# Altium schematic sheet HMC1001_module.SchDoc
size A1
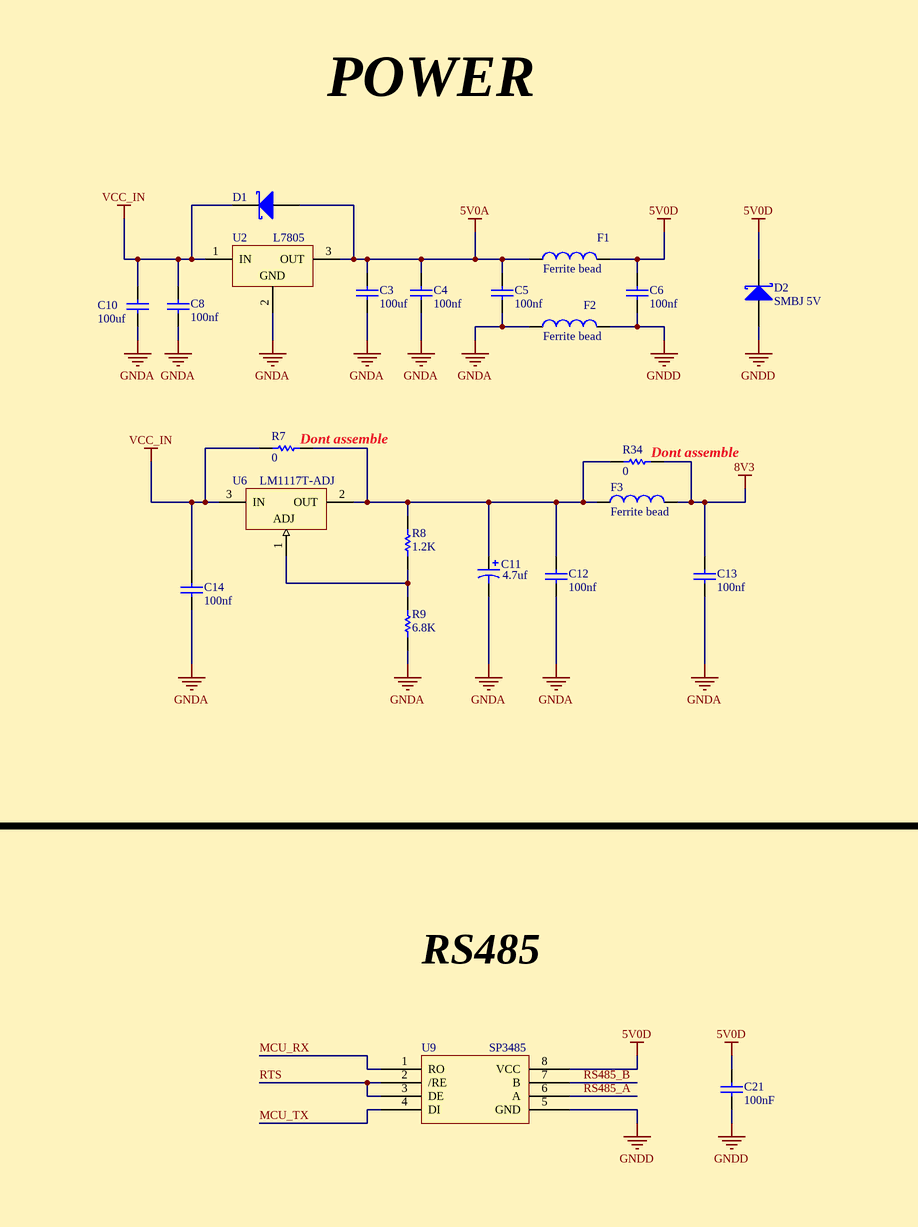
[diagram p0: HMC1001_module.SchDoc, top left]
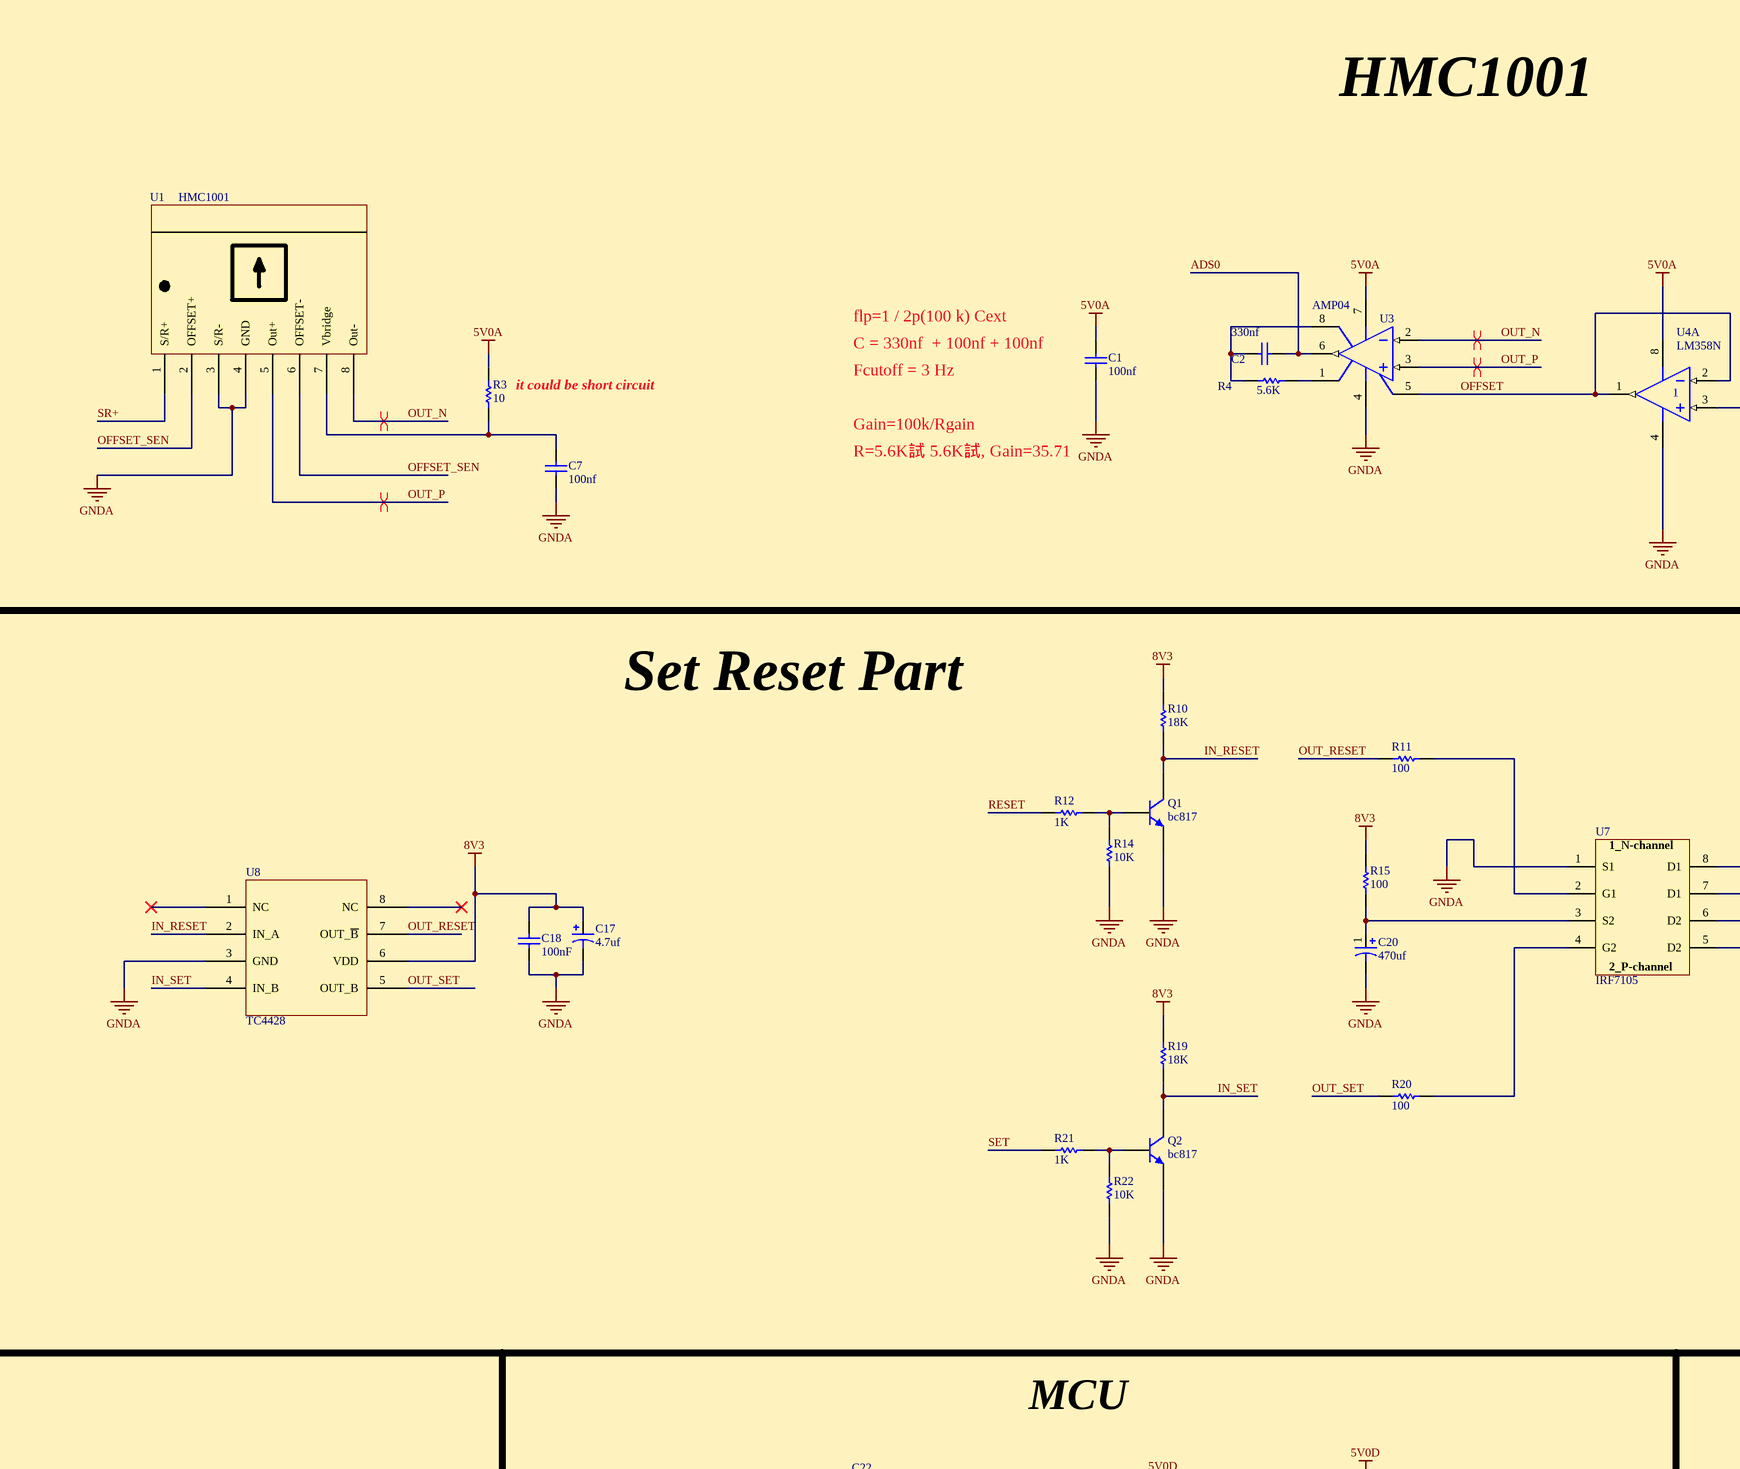
[diagram p1: HMC1001_module.SchDoc, top middle]
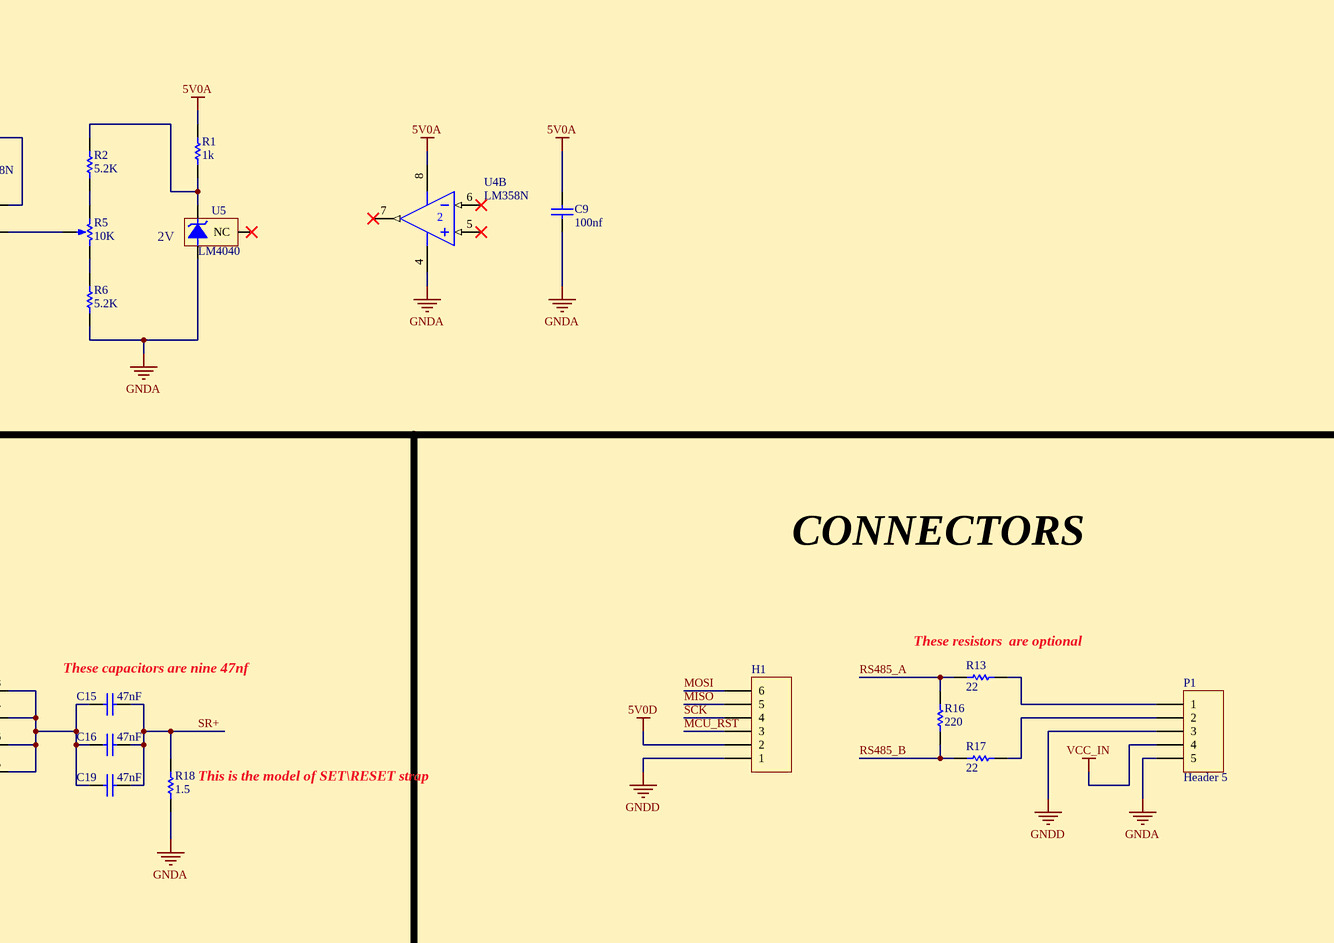
[diagram p2: HMC1001_module.SchDoc, top right]
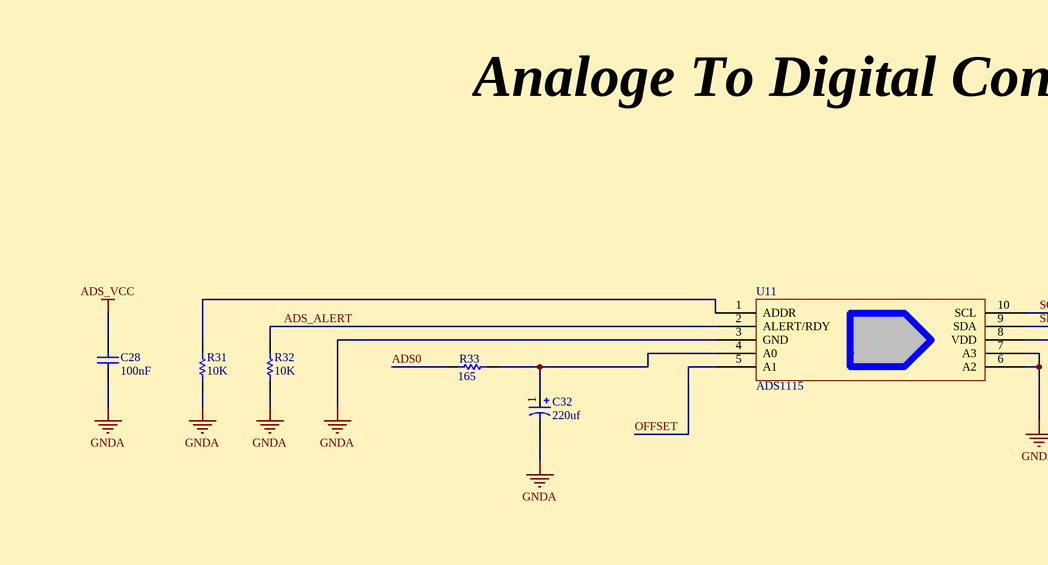
[diagram p3: HMC1001_module.SchDoc, bottom left]
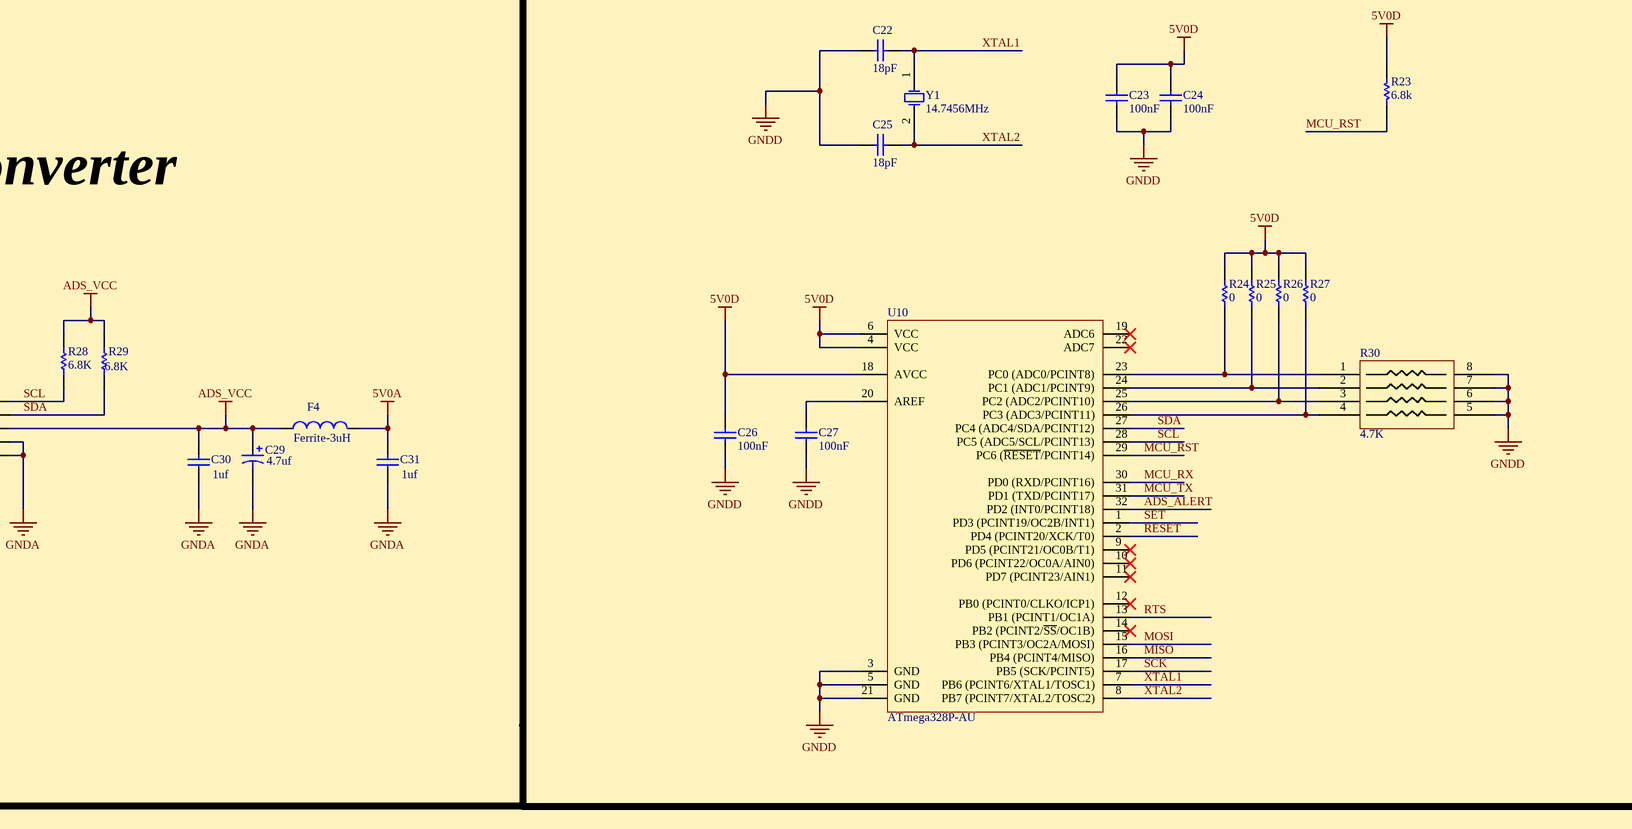
[diagram p4: HMC1001_module.SchDoc, bottom middle]
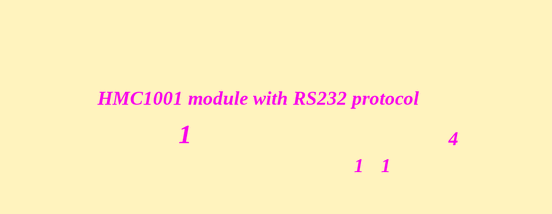
[diagram p5: HMC1001_module.SchDoc, bottom right]

## Parts
C1  100nf  [C0805]
C2  330nf  [C0805]
C3  100uf  [C1206]
C4  100nf  [C0805]
C5  100nf  [C0805]
C6  100nf  [C0805]
C7  100nf  [C0805]
C8  100nf  [C0805]
C9  100nf  [C0805]
C10  100uf  [C1206]
C11  4.7uf  [cap_smd_a]
C12  100nf  [C0805]
C13  100nf  [C0805]
C14  100nf  [C0805]
C15  47nF  [C1206]
C16  47nF  [C1206]
C17  4.7uf  [cap_smd_a]
C18  100nF  [C0805]
C19  47nF  [C1206]
C20  470uf  [cap_smd_d]
C21  100nF  [C0805]
C22  18pF  [C0805]
C23  100nF  [C0805]
C24  100nF  [C0805]
C25  18pF  [C0805]
C26  100nF  [C0805]
C27  100nF  [C0805]
C28  100nF  [C0805]
C29  4.7uf  [CAP_SMD_A]
C30  1uf  [C0805]
C31  1uf  [C0805]
C32  220uf  [cap_smd_d]
D1  D Schottky  [ZENER]  (value not drawn)
D2  SMBJ 5V  [TVS]
F1  Ferrite bead  [1206]
F2  Ferrite bead  [1206]
F3  Ferrite bead  [1206]
F4  Ferrite-3uH  [1206]
H1  White SMD Connector 6pin  [SH_6pin_B]  (value not drawn)
P1  Header 5  [HDR_M_1x5]
Q1  bc817  [sot-23]
Q2  bc817  [sot-23]
R1  1k  [0805]
R2  5.2K  [0805]
R3  10  [0805]
R4  5.6K  [0805]
R5  value 10K  [POT_3296w]  (hidden comment: RPot)
R6  5.2K  [0805]
R7  0  [0603]
R8  1.2K  [0805]
R9  6.8K  [0805]
R10  18K  [0805]
R11  100  [0805]
R12  1K  [0805]
R13  22  [0805]
R14  10K  [0805]
R15  100  [0805]
R16  220  [0805]
R17  22  [0805]
R18  1.5  [0805]
R19  18K  [0805]
R20  100  [0805]
R21  1K  [0805]
R22  10K  [0805]
R23  6.8k  [0805]
R24  0  [0603]
R25  0  [0603]
R26  0  [0603]
R27  0  [0603]
R28  6.8K  [0805]
R29  6.8K  [0805]
R30  4.7K  [RP0603X4]
R31  10K  [0805]
R32  10K  [0805]
R33  165  [0805]
R34  0  [0603]
U1  HMC1001  [HMC1001]
U2  L7805  [DPAK]
U3  AMP04  [sop8]
U4  LM358N  [sop8]  (parts A,B of 2)
U5  LM4040  [sot-23]
U6  LM1117T-ADJ  [DPAK]
U7  IRF7105  [sop8]
U8  TC4428  [sop8]
U9  SP3485  [SOP8]
U10  ATmega328P-AU  [32A_L]
U11  ADS1115  [TSSOP10_N]
Y1  14.7456MHz  [XTALL]

## Nets
5V0A: C1.2 C3.2 C4.2 C5.2 C9.2 C31.2 D1.1(A) F1.1 F4.2 R1.2 R3.2 U2.3(OUT) U3.7(V+) U4.8(V+)
5V0D: C6.2 C21.2 C23.2 C24.2 C26.2 D2.2(K) F1.2 H1.2 R23.1 R24.1 R25.1 R26.1 R27.1 U9.8(VCC) U10.4(VCC) U10.6(VCC) U10.18(AVCC)
8V3: C13.2 C17.1 C18.1 F3.2 R10.2 R15.1 R19.2 R34.1 U8.6(VDD)
ADS_VCC: C28.2 C29.1 C30.2 F4.1 R28.1 R29.1 U11.8(VDD)
GNDA: C1.1 C3.1 C4.1 C5.1 C7.1 C8.1 C9.1 C10.1 C11.2 C12.1 C13.1 C14.1 C17.2 C18.2 C20.2 C28.1 C29.2 C30.1 C31.1 C32.2 F2.1 P1.5 Q1.2(E) Q2.2(E) R6.1 R9.1 R14.1 R18.2 R22.1 R31.1 R32.1 U1.3(S/R-) U1.4(GND) U2.2(GND) U3.4(V-) U4.4(V-) U5.2(-V) U7.1(S1) U8.3(GND) U11.3(GND) U11.6(A2) U11.7(A3)
GNDD: C6.1 C21.1 C22.1 C23.1 C24.1 C25.1 C26.1 C27.1 D2.1(A) F2.2 H1.1 P1.3 R30.5 R30.6 R30.7 R30.8 U9.5(GND) U10.3(GND) U10.5(GND) U10.21(GND)
VCC_IN: C8.2 C10.2 C14.2 D1.2(K) P1.4 R7.2 U2.1(IN) U6.3(IN)
ADS0: C2.1 R33.1 U3.6(OUT)
ADS_ALERT: R32.2 U10.32(PD2_(INT0/PCINT18)) U11.2(ALERT/RDY)
IN_RESET: Q1.3(C) R10.1 U8.2(IN_A)
IN_SET: Q2.3(C) R19.1 U8.4(IN_B)
MCU_RST: H1.3 R23.2 U10.29(PC6_(~{RESET}/PCINT14))
MCU_RX: U9.1(RO) U10.30(PD0_(RXD/PCINT16))
MCU_TX: U9.4(DI) U10.31(PD1_(TXD/PCINT17))
MISO: H1.5 U10.16(PB4_(PCINT4/MISO))
MOSI: H1.6 U10.15(PB3_(PCINT3/OC2A/MOSI))
OFFSET: U3.5(OS_NUL) U4.1(OUT) U4.2(IN-) U11.5(A1)
OFFSET_SEN: U1.2(OFFSET+) U1.6(OFFSET-)
OUT_N: U1.8(Out-) U3.2(IN-)
OUT_P: U1.5(Out+) U3.3(IN+)
OUT_RESET: R11.2 U8.7(OUT_~{B})
OUT_SET: R20.2 U8.5(OUT_B)
RESET: R12.1 U10.2(PD4_(PCINT20/XCK/T0))
RS485_A: R13.1 R16.1 U9.6(A)
RS485_B: R16.2 R17.1 U9.7(B)
RTS: U9.2(/RE) U9.3(DE) U10.13(PB1_(PCINT1/OC1A))
SCK: H1.4 U10.17(PB5_(SCK/PCINT5))
SCL: R28.2 U10.28(PC5_(ADC5/SCL/PCINT13)) U11.10(SCL)
SDA: R29.2 U10.27(PC4_(ADC4/SDA/PCINT12)) U11.9(SDA)
SET: R21.1 U10.1(PD3_(PCINT19/OC2B/INT1))
SR+: C15.2 C16.2 C19.2 R18.1 U1.1(S/R+)
XTAL1: C22.2 U10.7(PB6_(PCINT6/XTAL1/TOSC1)) Y1.1(OSC1)
XTAL2: C25.2 U10.8(PB7_(PCINT7/XTAL2/TOSC2)) Y1.2(OSC2)
NetC2_2: C2.2 R4.1 U3.8(TAB)
NetC7_2: C7.2 R3.1 U1.7(Vbridge)
NetC11_1: C11.1 C12.2 F3.1 R7.1 R8.2 R34.2 U6.2(OUT)
NetC15_1: C15.1 C16.1 C19.1 U7.5(D2) U7.6(D2) U7.7(D1) U7.8(D1)
NetC20_1: C20.1 R15.2 U7.3(S2)
NetC27_2: C27.2 U10.20(AREF)
NetC32_1: C32.1 R33.2 U11.4(A0)
NetP1_1: P1.1 R13.2
NetP1_2: P1.2 R17.2
NetQ1_1: Q1.1(B) R12.2 R14.2
NetQ2_1: Q2.1(B) R21.2 R22.2
NetR1_1: R1.1 R2.2 U5.1(+V)
NetR2_1: R2.1 R5.3(BOT)
NetR4_2: R4.2 U3.1(OS_NUL)
NetR5_1: R5.1(TOP) R6.2
NetR5_2: R5.2(TAP) U4.3(IN+)
NetR8_1: R8.1 R9.2 U6.1(ADJ)
NetR11_1: R11.1 U7.2(G1)
NetR20_1: R20.1 U7.4(G2)
NetR24_2: R24.2 R30.1 U10.23(PC0_(ADC0/PCINT8))
NetR25_2: R25.2 R30.2 U10.24(PC1_(ADC1/PCINT9))
NetR26_2: R26.2 R30.3 U10.25(PC2_(ADC2/PCINT10))
NetR27_2: R27.2 R30.4 U10.26(PC3_(ADC3/PCINT11))
NetR31_2: R31.2 U11.1(ADDR)

Not connected (* = marked no-connect by the designer): U4 5(IN+)* 6(IN-)* 7(OUT)*; U5 3(NC)*; U8 1(NC)* 8(NC)*; U10 9(PD5_(PCINT21/OC0B/T1))* 10(PD6_(PCINT22/OC0A/AIN0))* 11(PD7_(PCINT23/AIN1))* 12(PB0_(PCINT0/CLKO/ICP1))* 14(PB2_(PCINT2/~{SS}/OC1B))* 19(ADC6)* 22(ADC7)*

## Layout directives
differential pair: OUT_N, OUT_P

## Notes on the sheet
- HMC1001
- POWER
- flp=1 / 2p(100 k) Cext
- (near R3) it could be short circuit
- (near C1) C = 330nf  + 100nf + 100nf
- Fcutoff = 3 Hz
- Gain=100k/Rgain
- R=5.6K試 5.6K試, Gain=35.71
- (near U5) 2V
- (near R7) Dont assemble
- (near R34) Dont assemble
- Set Reset Part
- CONNECTORS
- (near C15) These capacitors are nine 47nf
- (near R13) These resistors  are optional
- (near R18) This is the model of SET\RESET strap
- RS485
- MCU
- Analoge To Digital Converter
- HMC1001 module with RS232 protocol
- 1
- 4
- (in symbol IRF7106) 1_N-channel; 2_P-channel

## Library data of the parts
C1 C2 C7 C9 C12-C16 C18 C19 C21-C28 = Cap: Capacitor; Published: 8-Jun-2000; LatestRevisionDate: 17-Jul-2002; LatestRevisionNote: Re-released for DXP Platform.; PackageReference: RAD-0.3; Publisher: Altium Limited
  C1 C7 C9 C12-C14: PackageDescription: Radial Cap, Thru-Hole; 2 Leads; 0.3 in Pin Spacing; Value: 100nf
  C2: PackageDescription: Radial Cap, Thru-Hole; 2 Leads; 0.3 in Pin Spacing; Value: 330nf
  C15 C16 C19: PackageDescription: Radial Cap, Thru-Hole; 2 Leads; 0.3 in Pin Spacing; Value: 47nF
  C18: PackageDescription: Radial Cap, Thru-Hole; 2 Leads; 0.3 in Pin Spacing; Value: 100nF
  C21 C23 C24 C26-C28: Value: 100nF
  C22 C25: Value: 18pF
C3-C6 C8 C10 C30 C31 = Cap: Capacitor, 1206; Published: 8-Jun-2000; LatestRevisionDate: 17-Jul-2002; LatestRevisionNote: Re-released for DXP Platform.; PackageReference: RAD-0.3; Publisher: Altium Limited
  C3 C10: Value: 100uf
  C4-C6 C8: Value: 100nf
  C30 C31: PackageDescription: Radial Cap, Thru-Hole; 2 Leads; 0.3 in Pin Spacing; Value: 1uf
C11 C17 = Cap Pol1: Polarized Capacitor (Radial); Published: 8-Jun-2000; LatestRevisionDate: 17-Jul-2002; LatestRevisionNote: Re-released for DXP Platform.; PackageReference: RB7.6-15; Publisher: Altium Limited; PackageDescription: Polarized Capacitor (Radial); 2 Leads; Value: 4.7uf
C20 C32 = Cap Pol1: TAN CAP D SIZE; Published: 8-Jun-2000; LatestRevisionDate: 17-Jul-2002; LatestRevisionNote: Re-released for DXP Platform.; PackageReference: RB7.6-15; Publisher: Altium Limited; PackageDescription: Polarized Capacitor (Radial); 2 Leads
  C20: Value: 470uf
  C32: Value: 220uf
C29 = Cap Pol: Tantalium Capacitor; Published: 8-Jun-2000; LatestRevisionDate: 17-Jul-2002; LatestRevisionNote: Re-released for DXP Platform.; PackageReference: POLAR0.8; Publisher: Altium Limited; PackageDescription: Polarized Capacitor; 2 Leads; Value: 4.7uf
D1 = D Schottky: Schottky Diode, 1N4148; Published: 8-Jun-2000; LatestRevisionDate: 17-Jul-2002; LatestRevisionNote: Re-released for DXP Platform.; PackageReference: SMB; Publisher: Altium Limited; Code_JEDEC: DO-214-AA
D2 = Diode 18TQ045: Schottky Rectifier; Note: Terminal 2 is the TAB and is electrically connected to the cathode; Published: 8-Jun-2000; LatestRevisionDate: 17-Jul-2002; LatestRevisionNote: Re-released for DXP Platform.; DatasheetVersion: Dec-1997; PackageVersion: Feb-1998; PackageReference: TO-220AC; Publisher: Altium Limited; ComponentLink1Description: Manufacturer Link; ComponentLink1URL: http://www.irf.com/; ComponentLink2Description: Datasheet; ComponentLink2URL: http://www.irf.com/product-info/datasheets/data/18tq.pdf
F1-F3 = Inductor: Ferrite bead, 1206; Code_IEC: 1005; Value: 10mH; Published: 8-Jun-2000; LatestRevisionDate: 29-May-2009; LatestRevisionNote: IPC-7351 Footprint Added.; PackageReference: 0402-A; Publisher: Altium Limited; PackageDescription: Chip Inductor; Code_JEITA: 0402
F4 = Inductor: Code_IEC: 1005; Published: 8-Jun-2000; LatestRevisionDate: 29-May-2009; LatestRevisionNote: IPC-7351 Footprint Added.; PackageReference: 0402-A; Publisher: Altium Limited; PackageDescription: Chip Inductor; Code_JEITA: 0402
H1 = Header 6: LatestRevisionDate: 17-Jul-2002; LatestRevisionNote: Re-released for DXP Platform.; Publisher: Altium Limited
P1 = Header 5: Header, 5-Pin; LatestRevisionDate: 17-Jul-2002; LatestRevisionNote: Re-released for DXP Platform.; Publisher: Altium Limited
Q1 Q2 = 2N3904: NPN General Purpose Amplifier; Published: 8-Jun-2000; LatestRevisionDate: 15-Jan-2003; LatestRevisionNote: PCB Footprint 'BCY-W3/D4.7' replaced; DatasheetVersion: 1997; PackageVersion: Sep-1998; PackageReference: TO-92A; Publisher: Altium Limited; PackageDescription: TO, Flat Index; 3 In-Line, Axial Leads; Body Dia. 4.5mm; Leads 0.51 x 0.48 mm (max); ComponentLink1Description: Manufacturer Link; ComponentLink1URL: http://www.fairchildsemi.com/; ComponentLink2Description: Datasheet; ComponentLink2URL: http://www.fairchildsemi.com/ds/2N%2F2N3904.pdf
R1 R3 R7-R9 R34 = Resistor: Email: razi.vesali@gmail.com; Published: 17-Jun-2016; LatestRevisionNote: Re-released for puplic; Publisher: Seyed Razi Vesali
  R1: Value: 1k
  R3: Value: 10
  R7 R34: Value: 0
  R8: Value: 1.2K
  R9: Value: 6.8K
R2 R4 R6 R28 R29 R31-R33 = Resistor: General Resistor; Published: 8-Jun-2000; LatestRevisionDate: 17-Jul-2002; LatestRevisionNote: Re-released for DXP Platform.; PackageReference: AXIAL-0.3; Publisher: Altium Limited; PackageDescription: Axial Device, Thru-Hole; 2 Leads; 0.3 in Pin Spacing
  R2 R6: Value: 5.2K
  R4: Value: 5.6K
  R28 R29: Value: 6.8K
  R31 R32: Value: 10K
  R33: Value: 165
R5 = RPot: Potentiometer; Sim Note: Enter the Resistance value and the set point into parameter fields.; Set Position: 0.5; Published: 8-Jun-2000; LatestRevisionDate: 17-Jul-2002; LatestRevisionNote: Re-released for DXP Platform.; PackageReference: VR5; Publisher: Altium Limited
R10-R22 = Res1: Resistor; Published: 8-Jun-2000; LatestRevisionDate: 17-Jul-2002; LatestRevisionNote: Re-released for DXP Platform.; PackageReference: AXIAL-0.3; Publisher: Altium Limited
  R10 R19: PackageDescription: Axial Device, Thru-Hole; 2 Leads; 0.3 in Pin Spacing; Value: 18K
  R11 R15 R20: PackageDescription: Axial Device, Thru-Hole; 2 Leads; 0.3 in Pin Spacing; Value: 100
  R12 R21: PackageDescription: Axial Device, Thru-Hole; 2 Leads; 0.3 in Pin Spacing; Value: 1K
  R13 R17: Value: 22
  R14 R22: PackageDescription: Axial Device, Thru-Hole; 2 Leads; 0.3 in Pin Spacing; Value: 10K
  R16: Value: 220
  R18: PackageDescription: Axial Device, Thru-Hole; 2 Leads; 0.3 in Pin Spacing; Value: 1.5
R23-R27 = Res1: Resistor, 6.8k; Published: 8-Jun-2000; LatestRevisionDate: 17-Jul-2002; LatestRevisionNote: Re-released for DXP Platform.; PackageReference: AXIAL-0.3; Publisher: Altium Limited
  R23: Value: 6.8k
  R24-R27: Value: 0
R30 = RES_ARRAY_4: Value: 4.7K
U2 = L7805CD2T: Positive Voltage Regulator; Published: 24-Aug-2001; LatestRevisionDate: 17-Jul-2002; LatestRevisionNote: Re-released for DXP Platform.; DatasheetVersion: Dec-1998; PackageReference: TO-263; Publisher: Altium Limited; PackageDescription: D2-PAK/TO-263-AB; 3 Leads (1 Cropped); Body 15.9 (inc. leads) x 10.4 mm (LxW max); ComponentLink1Description: Manufacturer Link; ComponentLink1URL: http://www.st.com/
U3 = Op Amp: Published: 8-Jun-2000; LatestRevisionDate: 17-Jul-2002; LatestRevisionNote: Re-released for DXP Platform.; DatasheetVersion: REV. B; PackageVersion: 1990; PackageReference: H-08A; Publisher: Altium Limited; PackageDescription: Can; 8 Leads; Pin Circle Dia. 5.08 mm; Lead Dia. 0.53 mm (max); ComponentLink1Description: Manufacturer Link; ComponentLink1URL: http://www.analog.com/
U4 = LM358N: Dual Low-Power Operational Amplifier; Published: 17-Jul-2002; LatestRevisionDate: 06-Jun-2005; LatestRevisionNote: Stylized 3D Model Added.; DatasheetVersion: 1988; PackageReference: 626-05; Publisher: Altium Limited; PackageDescription: DIP; 8 Leads; Row Spacing 7.62 mm; Pitch 2.54 mm; ComponentLink1Description: Manufacturer Link; ComponentLink1URL: http://www.onsemi.com/site/products/parametrics/0,4446,251,00.html; ComponentLink2Description: Datasheet; ComponentLink2URL: http://www.onsemi.com/pub/Collateral/LM358-D.PDF
U5 = LM4040: Precision Micropower Shunt Voltage Reference, 3-pin SOT-23; PartNumber: LM4040DIM3-10.0; Manufacturer: National Semiconductor; PackageTopMarking: R0D*XTT; PowerWise: N; CompType: Voltage Reference IC; Published: 4-Dec-2008; DatasheetVersion: Apr-2005; PackageVersion: revB, Mar-2003; PackageReference: MF03A; Publisher: Altium Limited; PackageDescription: Molded SOT-23, .115 x .051 x .037in Body, 3 Lead, .075 in Pitch; RoHS: N; PinCount: 3; ComponentLink1Description: LM4040 Datasheet; ComponentLink1URL: http://www.national.com/ds/LM/LM4040.pdf; ComponentLink2Description: LM4040 Web Page; ComponentLink2URL: http://www.national.com/pf/LM/LM4040.html; ComponentLink3Description: MF03A Package Page; ComponentLink3URL: http://www.national.com/packaging/folders/mf03a.html
U6 = LM1117T-ADJ: 800mA Low-Dropout Linear Regulator; Manufacturer: National Semiconductor; CompType: LDO IC; PackageTopMarking: NSUZXYTTE#*LM1117T*ADJ; PowerWise: N; Published: 4-Dec-2008; DatasheetVersion: Apr-2006; PackageVersion: revL, Jan-1992; PackageReference: T03B; Publisher: Altium Limited; PackageDescription: TO-220, Molded, 3 Lead, Straight; PartNumber: LM1117T-ADJ; RoHS: O; PinCount: 3; DigiKeyPartNumber: LM1117T-ADJ-ND; ComponentLink1Description: LM1117 Datasheet; ComponentLink1URL: http://www.national.com/ds/LM/LM1117.pdf; ComponentLink2Description: LM1117 Web Page; ComponentLink2URL: http://www.national.com/pf/LM/LM1117.html; ComponentLink3Description: T03B Package Page; ComponentLink3URL: http://www.national.com/packaging/folders/t03b.html
U7 = IRF7106
U9 = rs485
U10 = ATmega328P-AU: 8-bit AVR Microcontroller, 32KB Flash, 1KB EEPROM, 2KB SRAM, 32-pin TQFP, Industrial Grade (-40ｰC to 85ｰC); Published: 1-Apr-2010; DatasheetVersion: revA, Jan-2010; PackageVersion: revB, Oct-2001; PackageReference: 32A; Publisher: Altium Limited; PackageDescription: 32-Lead, 7x7x1.0 mm Body, 0.8mm Lead Pitch, Thin Profile Plastic Quad Flat Package (TQFP); Supplier 1: Digi-Key; Supplier Part Number 1: ATMEGA328P-AU-ND; Supplier 2: Farnell; Supplier Part Number 2: 1715486; Supplier 3: Mouser; Supplier Part Number 3: 556-ATMEGA328P-AU; Code_JEDEC: MS-026-ABA; ComponentLink1Description: Manufacturer Link; ComponentLink1URL: http://www.atmel.com/products/avr/default.asp?; ComponentLink2Description: ATmega48A/48PA/88A/88PA/168A/168PA/328/328P Datasheet; ComponentLink2URL: http://www.atmel.com/dyn/resources/prod_documents/8271.pdf; ComponentLink3Description: ATmega48A/48PA/88A/88PA/168A/168PA/328/328P Summary; ComponentLink3URL: http://www.atmel.com/dyn/resources/prod_documents/8271S.pdf; ComponentLink4Description: Atmel.com Home; ComponentLink4URL: http://www.atmel.com
Y1 = XTAL: Crystal Oscillator, 14.7456KHz; Published: 8-Jun-2000; LatestRevisionDate: 17-Jul-2002; LatestRevisionNote: Re-released for DXP Platform.; PackageReference: R38; Publisher: Altium Limited